# Altium schematic sheet MCU.SchDoc
size A3
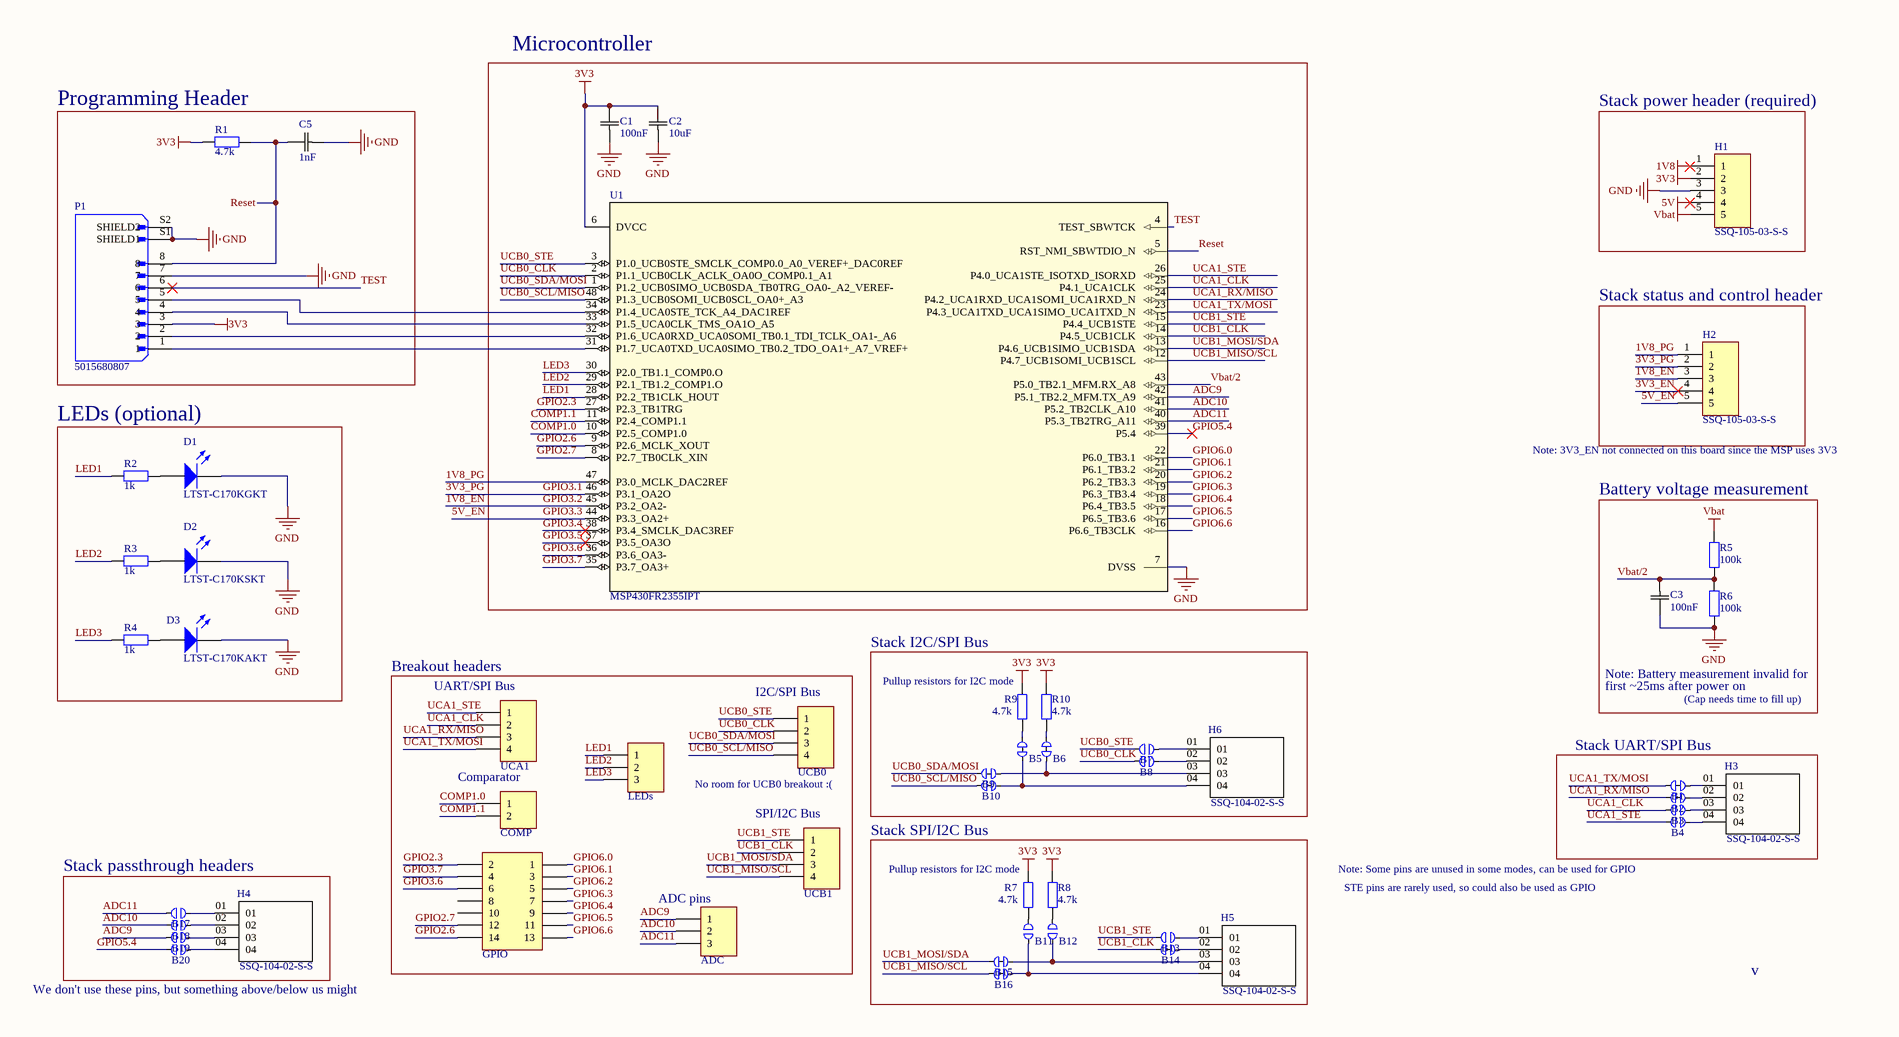
[diagram p0: MCU.SchDoc, left]
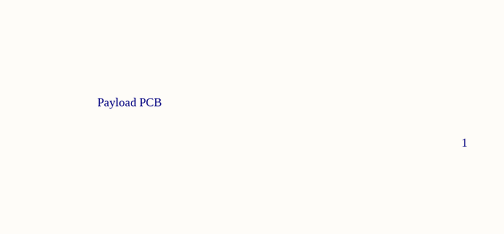
[diagram p1: MCU.SchDoc, right]

## Parts
ADC  Header 3  [HDR1X3]  (value not drawn)  (no BOM)
B1  Solder Jumper Normally Closed 0201  [Solder Bridge Closed 0201]  (value not drawn)  (net tie, no BOM)
B2  Solder Jumper Normally Closed 0201  [Solder Bridge Closed 0201]  (value not drawn)  (net tie, no BOM)
B3  Solder Jumper Normally Open 0201  [Solder Bridge Open 0201]  (value not drawn)  (no BOM)
B4  Solder Jumper Normally Open 0201  [Solder Bridge Open 0201]  (value not drawn)  (no BOM)
B5  Solder Jumper Normally Closed 0201  [Solder Bridge Closed 0201]  (value not drawn)  (net tie, no BOM)
B6  Solder Jumper Normally Closed 0201  [Solder Bridge Closed 0201]  (value not drawn)  (net tie, no BOM)
B7  Solder Jumper Normally Open 0201  [Solder Bridge Open 0201]  (value not drawn)  (no BOM)
B8  Solder Jumper Normally Open 0201  [Solder Bridge Open 0201]  (value not drawn)  (no BOM)
B9  Solder Jumper Normally Closed 0201  [Solder Bridge Closed 0201]  (value not drawn)  (net tie, no BOM)
B10  Solder Jumper Normally Closed 0201  [Solder Bridge Closed 0201]  (value not drawn)  (net tie, no BOM)
B11  Solder Jumper Normally Open 0201  [Solder Bridge Open 0201]  (value not drawn)  (no BOM)
B12  Solder Jumper Normally Open 0201  [Solder Bridge Open 0201]  (value not drawn)  (no BOM)
B13  Solder Jumper Normally Open 0201  [Solder Bridge Open 0201]  (value not drawn)  (no BOM)
B14  Solder Jumper Normally Closed 0201  [Solder Bridge Closed 0201]  (value not drawn)  (net tie, no BOM)
B15  Solder Jumper Normally Closed 0201  [Solder Bridge Closed 0201]  (value not drawn)  (net tie, no BOM)
B16  Solder Jumper Normally Closed 0201  [Solder Bridge Closed 0201]  (value not drawn)  (net tie, no BOM)
B17  Solder Jumper Normally Open 0201  [Solder Bridge Open 0201]  (value not drawn)  (no BOM)
B18  Solder Jumper Normally Open 0201  [Solder Bridge Open 0201]  (value not drawn)  (no BOM)
B19  Solder Jumper Normally Open 0201  [Solder Bridge Open 0201]  (value not drawn)  (no BOM)
B20  Solder Jumper Normally Open 0201  [Solder Bridge Open 0201]  (value not drawn)  (no BOM)
C1  100nF  [CAPC2012X94N]
C2  10uF  [CAPC2012X94N]
C3  100nF  [CAPC2012X94N]
C5  1nF  [CAPC2012X94N]
COMP  Header 2  [HDR1X2]  (value not drawn)  (no BOM)
D1  LTST-C170KGKT  [ECE-LED2012-0805SM]
D2  LTST-C170KSKT  [ECE-LED2012-0805SM]
D3  LTST-C170KAKT  [ECE-LED2012-0805SM]
GPIO  Header 7X2  [HDR2X7]  (value not drawn)  (no BOM)
H1  SSQ-105-03-S-S  [SAMTEC_SSQ-105-03-S-S]  (no BOM)
H2  SSQ-105-03-S-S  [SAMTEC_SSQ-105-03-S-S]  (no BOM)
H3  SSQ-104-02-S-S  [*SAMTEC_SSQ-104-02-S-S_SSQ-104-02-S-S(Primary)]  (no BOM)
H4  SSQ-104-02-S-S  [*SAMTEC_SSQ-104-02-S-S_SSQ-104-02-S-S(Primary)]  (no BOM)
H5  SSQ-104-02-S-S  [*SAMTEC_SSQ-104-02-S-S_SSQ-104-02-S-S(Primary)]  (no BOM)
H6  SSQ-104-02-S-S  [*SAMTEC_SSQ-104-02-S-S_SSQ-104-02-S-S(Primary)]  (no BOM)
LEDs  Header 3  [HDR1X3]  (value not drawn)  (no BOM)
P1  5015680807  [MOLEX_5015680807]
R1  4.7k  [0805]
R2  1k  [0805]
R3  1k  [0805]
R4  1k  [0805]
R5  100k  [0805]
R6  100k  [0805]
R7  4.7k  [0805]
R8  4.7k  [0805]
R9  4.7k  [0805]
R10  4.7k  [0805]
U1  MSP430FR2355IPT  [PT0048A_L]
UCA1  Header 4  [HDR1X4]  (value not drawn)  (no BOM)
UCB0  Header 4  [HDR1X4]  (value not drawn)  (no BOM)
UCB1  Header 4  [HDR1X4]  (value not drawn)  (no BOM)

## Blocks framed on the sheet
Microcontroller: C1 C2 U1
Programming Header: C5 P1 R1
Stack power header (required): H1
Stack status and control header: H2
LEDs (optional): D1-D3 R2-R4
Battery voltage measurement: C3 R5 R6
Stack I2C/SPI Bus: B5-B10 H6 R9 R10
Breakout headers: ADC COMP GPIO LEDs UCA1 UCB0 UCB1
Stack UART/SPI Bus: B1-B4 H3
Stack SPI/I2C Bus: B11-B16 H5 R7 R8
Stack passthrough headers: B17-B20 H4

## Nets
1V8: H1.1
3V3: C1.2 C2.2 H1.2 P1.3 R1.2 R7.2 R8.2 R9.2 R10.1 U1.6(DVCC)
5V: H1.4
GND: C1.1 C2.1 C3.2 C5.1 D1.2(K) D2.2(K) D3.2(K) H1.3 P1.7 P1.S1(SHIELD1) P1.S2(SHIELD2) R6.1 U1.7(DVSS)
Vbat: H1.5 R5.2
1V8_EN: H2.3 U1.45(P3.2_OA2-)  [also labelled GPIO3.2]
1V8_PG: H2.1 U1.47(P3.0_MCLK_DAC2REF)
3V3_EN: H2.4
3V3_PG: H2.2 U1.46(P3.1_OA2O)  [also labelled GPIO3.1]
5V_EN: H2.5 U1.44(P3.3_OA2+)  [also labelled GPIO3.3]
ADC9: ADC.1 B19.1 U1.42(P5.1_TB2.2_MFM.TX_A9)
ADC10: ADC.2 B18.1 U1.41(P5.2_TB2CLK_A10)
ADC11: ADC.3 B17.1 U1.40(P5.3_TB2TRG_A11)
COMP1.0: COMP.1 U1.10(P2.5_COMP1.0)
COMP1.1: COMP.2 U1.11(P2.4_COMP1.1)
GPIO2.3: GPIO.2 U1.27(P2.3_TB1TRG)
GPIO2.6: GPIO.14 U1.9(P2.6_MCLK_XOUT)
GPIO2.7: GPIO.12 U1.8(P2.7_TB0CLK_XIN)
GPIO3.4: U1.38(P3.4_SMCLK_DAC3REF)
GPIO3.5: U1.37(P3.5_OA3O)
GPIO3.6: GPIO.6 U1.36(P3.6_OA3-)
GPIO3.7: GPIO.4 U1.35(P3.7_OA3+)
GPIO5.4: B20.1 U1.39(P5.4)
GPIO6.0: GPIO.1 U1.22(P6.0_TB3.1)
GPIO6.1: GPIO.3 U1.21(P6.1_TB3.2)
GPIO6.2: GPIO.5 U1.20(P6.2_TB3.3)
GPIO6.3: GPIO.7 U1.19(P6.3_TB3.4)
GPIO6.4: GPIO.9 U1.18(P6.4_TB3.5)
GPIO6.5: GPIO.11 U1.17(P6.5_TB3.6)
GPIO6.6: GPIO.13 U1.16(P6.6_TB3CLK)
LED1: LEDs.1 R2.2 U1.28(P2.2_TB1CLK_HOUT)
LED2: LEDs.2 R3.2 U1.29(P2.1_TB1.2_COMP1.O)
LED3: LEDs.3 R4.2 U1.30(P2.0_TB1.1_COMP0.O)
Reset: C5.2 P1.8 R1.1 U1.5(RST_NMI_SBWTDIO_N)
TEST: P1.6 U1.4(TEST_SBWTCK)
UCA1_CLK: B3.1 U1.25(P4.1_UCA1CLK) UCA1.2
UCA1_RX/MISO: B2.1 U1.24(P4.2_UCA1RXD_UCA1SOMI_UCA1RXD_N) UCA1.3
UCA1_STE: B4.1 U1.26(P4.0_UCA1STE_ISOTXD_ISORXD) UCA1.1
UCA1_TX/MOSI: B1.1 U1.23(P4.3_UCA1TXD_UCA1SIMO_UCA1TXD_N) UCA1.4
UCB0_CLK: B8.2 U1.2(P1.1_UCB0CLK_ACLK_OA0O_COMP0.1_A1) UCB0.2
UCB0_SCL/MISO: B10.1 U1.48(P1.3_UCB0SOMI_UCB0SCL_OA0+_A3) UCB0.4
UCB0_SDA/MOSI: B9.2 U1.1(P1.2_UCB0SIMO_UCB0SDA_TB0TRG_OA0-_A2_VEREF-) UCB0.3
UCB0_STE: B7.2 U1.3(P1.0_UCB0STE_SMCLK_COMP0.0_A0_VEREF+_DAC0REF) UCB0.1
UCB1_CLK: B14.1 U1.14(P4.5_UCB1CLK) UCB1.2
UCB1_MISO/SCL: B16.1 U1.12(P4.7_UCB1SOMI_UCB1SCL) UCB1.4
UCB1_MOSI/SDA: B15.1 U1.13(P4.6_UCB1SIMO_UCB1SDA) UCB1.3
UCB1_STE: B13.1 U1.15(P4.4_UCB1STE) UCB1.1
Vbat/2: C3.1 R5.1 R6.2 U1.43(P5.0_TB2.1_MFM.RX_A8)
NetB1_2: B1.2 H3.01
NetB2_2: B2.2 H3.02
NetB3_2: B3.2 H3.03
NetB4_2: B4.2 H3.04
NetB5_1: B5.1 B10.2 H6.04
NetB5_2: B5.2 R9.1
NetB6_1: B6.1 R10.2
NetB6_2: B6.2 B9.1 H6.03
NetB7_1: B7.1 H6.01
NetB8_1: B8.1 H6.02
NetB11_1: B11.1 B16.2 H5.04
NetB11_2: B11.2 R7.1
NetB12_1: B12.1 R8.1
NetB12_2: B12.2 B15.2 H5.03
NetB13_2: B13.2 H5.01
NetB14_2: B14.2 H5.02
NetB17_2: B17.2 H4.01
NetB18_2: B18.2 H4.02
NetB19_2: B19.2 H4.03
NetB20_2: B20.2 H4.04
NetD1_1: D1.1(A) R2.1
NetD2_1: D2.1(A) R3.1
NetD3_1: D3.1(A) R4.1
NetP1_1: P1.1 U1.31(P1.7_UCA0TXD_UCA0SIMO_TB0.2_TDO_OA1+_A7_VREF+)
NetP1_2: P1.2 U1.32(P1.6_UCA0RXD_UCA0SOMI_TB0.1_TDI_TCLK_OA1-_A6)
NetP1_4: P1.4 U1.33(P1.5_UCA0CLK_TMS_OA1O_A5)
NetP1_5: P1.5 U1.34(P1.4_UCA0STE_TCK_A4_DAC1REF)

Not connected (* = marked no-connect by the designer): GPIO 8 10

## Notes on the sheet
- (near H2) Note: 3V3_EN not connected on this board since the MSP uses 3V3
- (near UCA1) UART/SPI Bus
- (near UCB0) I2C/SPI Bus
- Pullup resistors for I2C mode
- Note: Battery measurement invalid for
- first ~25ms after power on
- (Cap needs time to fill up)
- Comparator
- (near UCB0) No room for UCB0 breakout :(
- (near UCB1) SPI/I2C Bus
- Note: Some pins are unused in some modes, can be used for GPIO
- (near ADC) ADC pins
- STE pins are rarely used, so could also be used as GPIO
- Payload PCB
- We don't use these pins, but something above/below us might
- v
- 1

## Library data of the parts
ADC LEDs = Header 3: Header, 3-Pin
C1-C3 C5 = CAP 0805: No Description Available; IsInLabBook: Yes
  C1 C3: Value: 100nF
  C2: Value: 10uF
  C5: Value: 1nF
COMP = Header 2: Header, 2-Pin
D1 = DIO000105: LED GREEN CLEAR 0805 SMD; ALT PARTS: LTST-C190KGKT; MF: Lite-On Inc.; S1PN: 160-1414-1-ND; MCR: 20mA; MVP: Y; MVR: 2V; TEMP: 55 °C to + 85 °C; PKG: 0805; MFPN: LTST-C170KGKT; S1L: https://www.digikey.co.nz/product-detail/en/lite-on-inc/LTST-C170KGKT/160-1414-1-ND/386776; Value: LED
D2 = DIO000104: LED YELLOW CLEAR 0805 SM; ALT PARTS: LTST-C190KSKT; MF: Lite-On Inc.; S1PN: 160-1416-1-ND; MCR: 20mA; MVP: Y; MVR: 2V; TEMP: 55 °C to + 85 °C; PKG: 0805; S2PN: 859-LTST-C170KSKT; MFPN: LTST-C170KSKT; S1L: https://www.digikey.co.nz/product-detail/en/lite-on-inc/LTST-C170KSKT/160-1416-1-ND/386780; Value: LED; S2L: https://nz.mouser.com/ProductDetail/Lite-On/LTST-C170KSKT?qs=%2Fha2pyFaduiaE0aNI0zQNjcVUnE0q7HseH6H%252BEPh3n3lWm8h2QqBnQ%3D%3D
D3 = DIO000104: LED RED CLEAR 0805 SM; MF: Lite-On Inc.; MFPN: LTST-C190KAKT; S1PN: 160-1433-1-ND; MCR: 20mA; MVP: Y; MVR: 2V; TEMP: 55 °C to + 85 °C; PKG: 0603; S1L: https://www.digikey.co.nz/en/products/detail/lite-on-inc/LTST-C190KAKT/386811; Value: LED; ALT PARTS: LTST-C190KAKT
GPIO = Header 7X2: Header, 7-Pin, Dual row
H1 H2 = SSQ-105-03-S-S: MF: {'manufacturer': u'Samtec Inc.'}; Package: None; Price: None; Value: *; MP: SSQ-105-03-S-S; Availability: Unavailable
R1-R10 = Resistor: IsInLabBook: Yes
  R1 R7-R10: Value: 4.7k
  R2-R4: Value: 1k
  R5 R6: Value: 100k
U1 = MSP430FR2355IPT: Imported; Manufacturer: Texas Instruments; PartNumber: MSP430FR2355IPT
UCA1 UCB0 UCB1 = Header 4: Header, 4-Pin
B1 B2 B5 B6 B9 B10 B14-B16 = Solder Jumper Normally Closed 0201: DEBUG: DEBUG
B3 B4 B7 B8 B11-B13 B17-B20 = Solder Jumper Normally Open 0201: DEBUG: DEBUG
H3-H6 = SSQ-104-02-S-S: SnapEDA_Link: https://www.snapeda.com/parts/SSQ-104-02-S-S/Samtec/view-part/?ref=snap; Check_prices: https://www.snapeda.com/parts/SSQ-104-02-S-S/Samtec/view-part/?ref=eda; Value: *
P1 = 5015680807: Availability: Unavailable; MP: 5015680807; Value: *; Price: None; Package: None